# EAGLE schematic L%26R_Overcurrent_Analog (EAGLE 6.4)
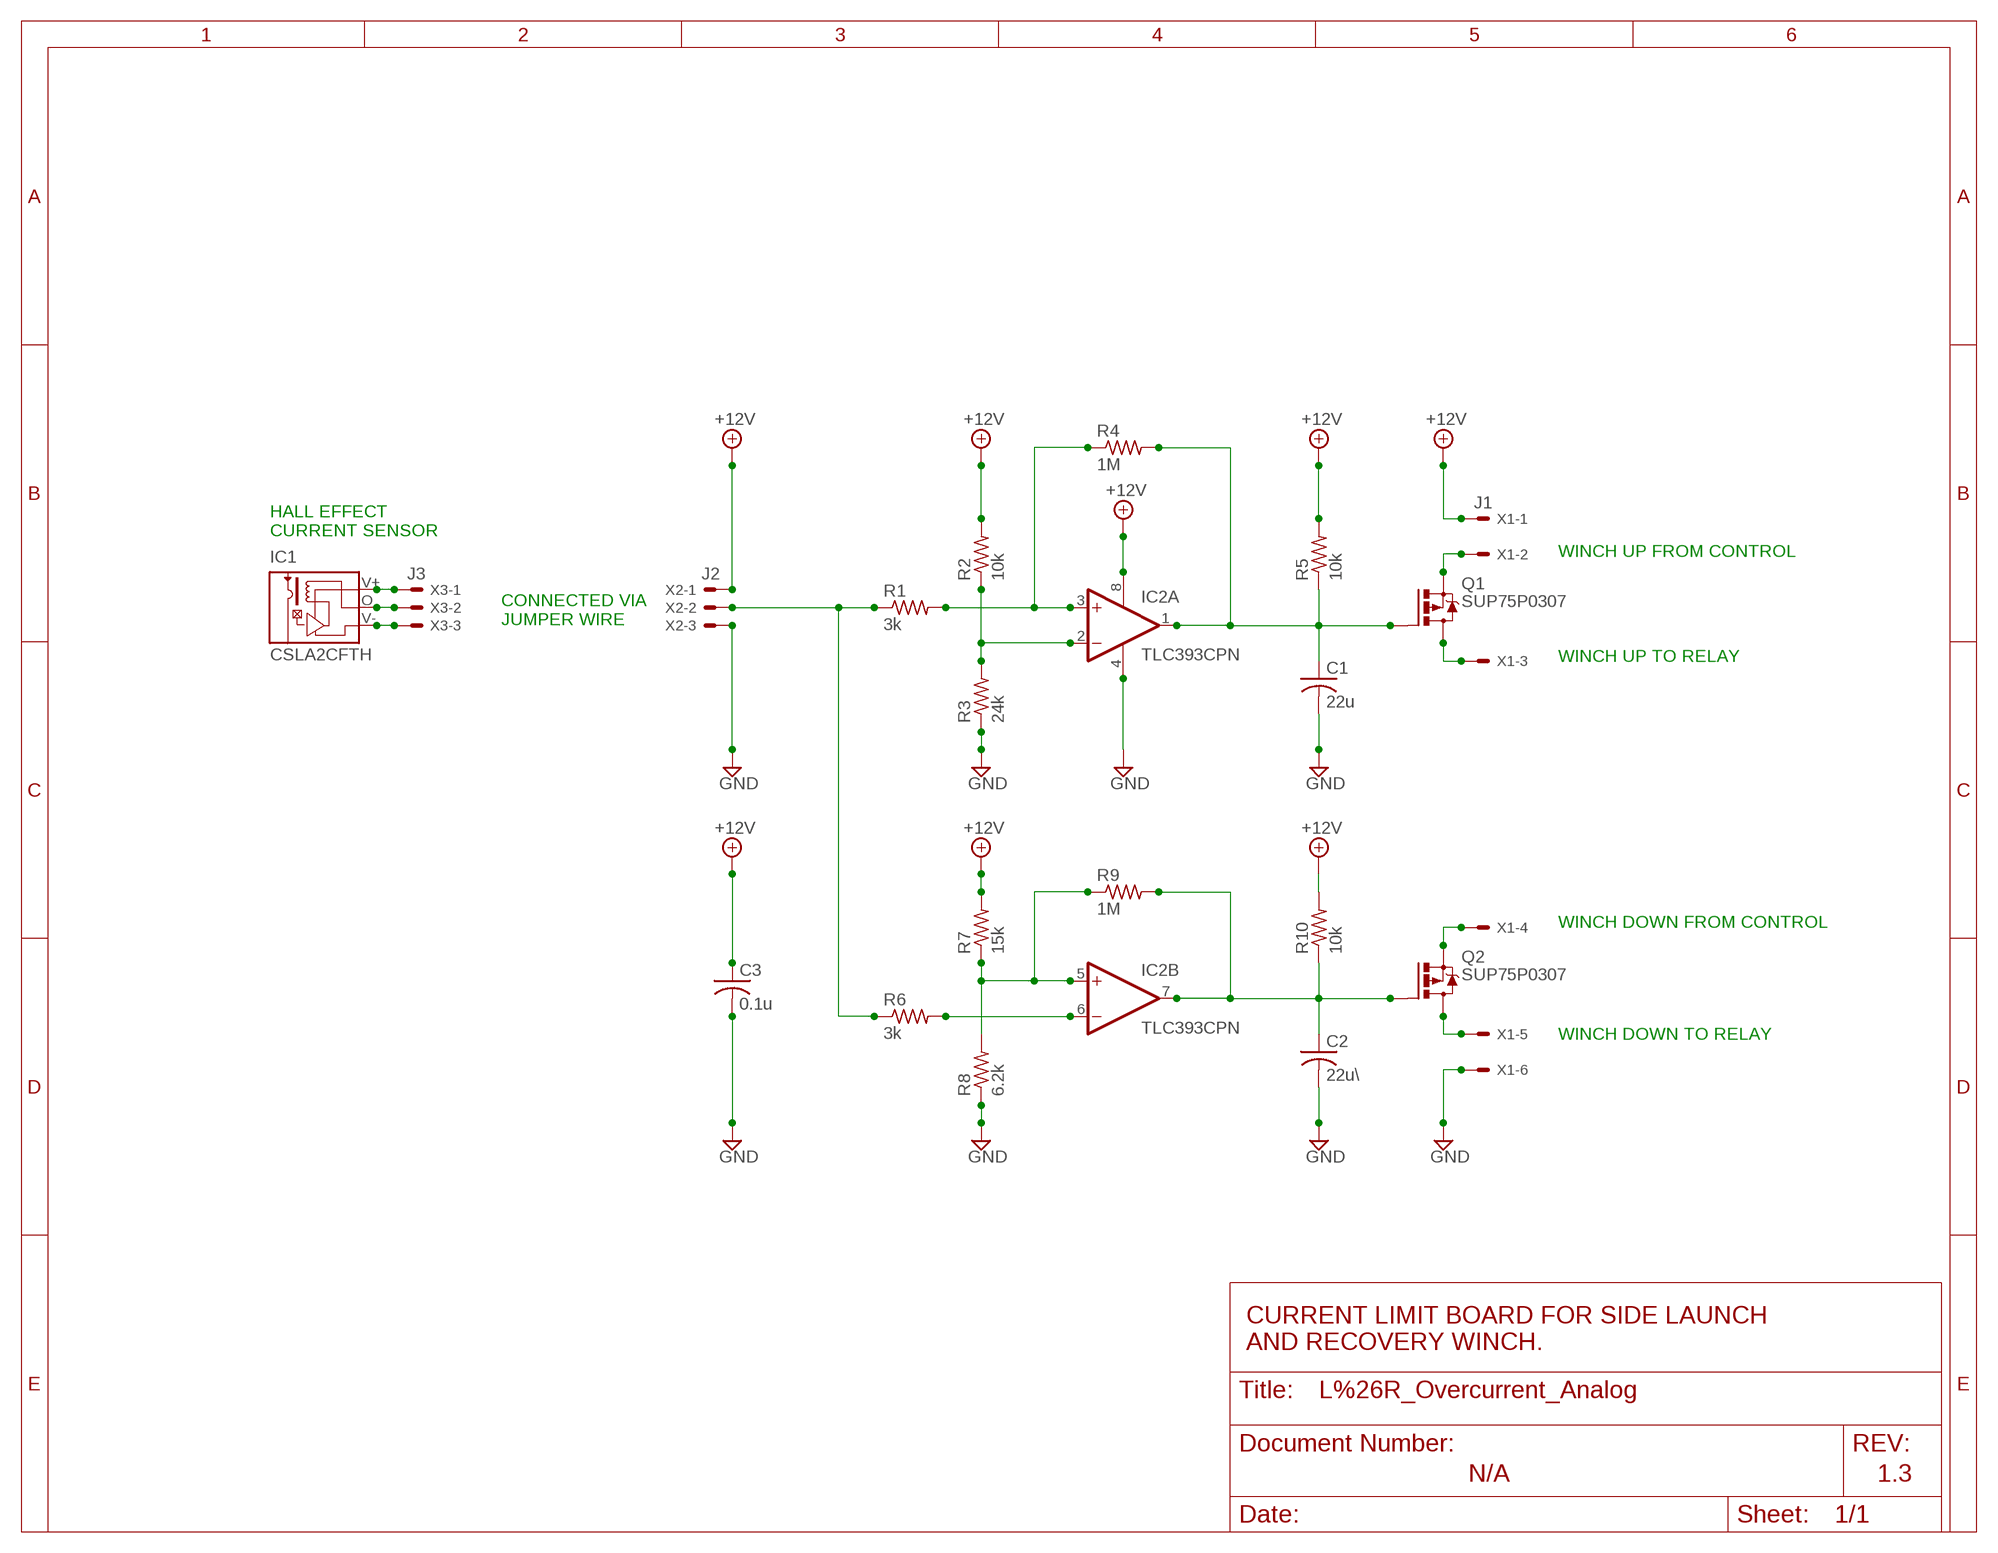
[diagram p0: schematic, sheet 1]

## Parts
C1  22u  CAPACITOR-US025-050X050  [C025-050X050]
C2  22u\  CAPACITOR-US025-050X050  [C025-050X050]
C3  0.1u  CAPACITOR-US  [C050-024X044]
IC1  CSLA2CFTH  [CSLA2CF]
IC2  TLC393CPN  [DIL08]
Q1  SUP75P0307  [TO220BV]
Q2  SUP75P0307  [TO220BV]
R1  3k  RESISTOR-US0204/7  [0204/7]
R2  10k  RESISTOR-US0204/7  [0204/7]
R3  24k  RESISTOR-US0204/7  [0204/7]
R4  1M  RESISTOR-US0204/7  [0204/7]
R5  10k  RESISTOR-US0204/7  [0204/7]
R6  3k  RESISTOR-US0204/7  [0204/7]
R7  15k  RESISTOR-US0204/7  [0204/7]
R8  6.2k  RESISTOR-US0204/7  [0204/7]
R9  1M  RESISTOR-US0204/7  [0204/7]
R10  10k  RESISTOR-US0204/7  [0204/7]
X1  J1  6PIN_HEADER  [22-23-2061]
X2  J2  22-23-2031  [22-23-2031]
X3  J3  22-23-2031  [22-23-2031]

## Nets
+12V: C3.1 IC2.8(P:V+) R2.2 R5.2 R7.2 R10.2 X1.1 X2.1
GND: C1.2 C2.2 C3.2 IC2.4(P:V-) R3.1 R8.1 X1.6 X2.3
N$1: IC2.3(A:+IN) R1.2 R4.1
N$2: IC2.2(A:-IN) R2.1 R3.2
N$4: IC2.6(B:-IN) R6.2
N$5: IC2.5(B:+IN) R7.1 R8.2 R9.1
N$6: C1.1 IC2.1(A:OUT) Q1.G R4.2 R5.1
N$7: C2.1 IC2.7(B:OUT) Q2.G R9.2 R10.1
N$8: Q1.S X1.2
N$9: Q1.D X1.3
N$10: Q2.S X1.4
N$11: Q2.D X1.5
N$12: IC1.V+ X3.1
N$13: IC1.V- X3.3
N$14: IC1.O(M) X3.2
N$15: R1.1 R6.1 X2.2

## Notes on the sheet
- HALL EFFECT
  CURRENT SENSOR
- WINCH UP FROM CONTROL
- CONNECTED VIA
  JUMPER WIRE
- WINCH UP TO RELAY
- WINCH DOWN FROM CONTROL
- WINCH DOWN TO RELAY
- CURRENT LIMIT BOARD FOR SIDE LAUNCH
  AND RECOVERY WINCH.
- N/A | 1.3

## Library data of the parts
C1-C3 = Overcurrent Detect:CAPACITOR-US: CAPACITOR, American symbol
IC1 = Overcurrent Detect:CSLA2CF: Current Transducer CSLA2CF For the electronic measurement of currents: DC, AC Source: Data sheet <http://sensing.honeywell.com/product%20page?pr_id=4790>
IC2 = Overcurrent Detect:TLC393CP: COMPARATOR
Q1 Q2 = Overcurrent Detect:SUP75P03: P-Channel Power MOSFET
R1-R10 = Overcurrent Detect:RESISTOR-US: RESISTOR, American symbol
X1 = Overcurrent Detect:6PIN_HEADER: .100" (2.54mm) Center Header - 6 Pin; MF: MOLEX; MPN: 22-23-2061; OC_FARNELL: 1462922; OC_NEWARK: 27C1933
X2 X3 = Overcurrent Detect:22-23-2031: .100" (2.54mm) Center Header - 3 Pin; MF: MOLEX; MPN: 22-23-2031; OC_FARNELL: 1462950; OC_NEWARK: 30C0862